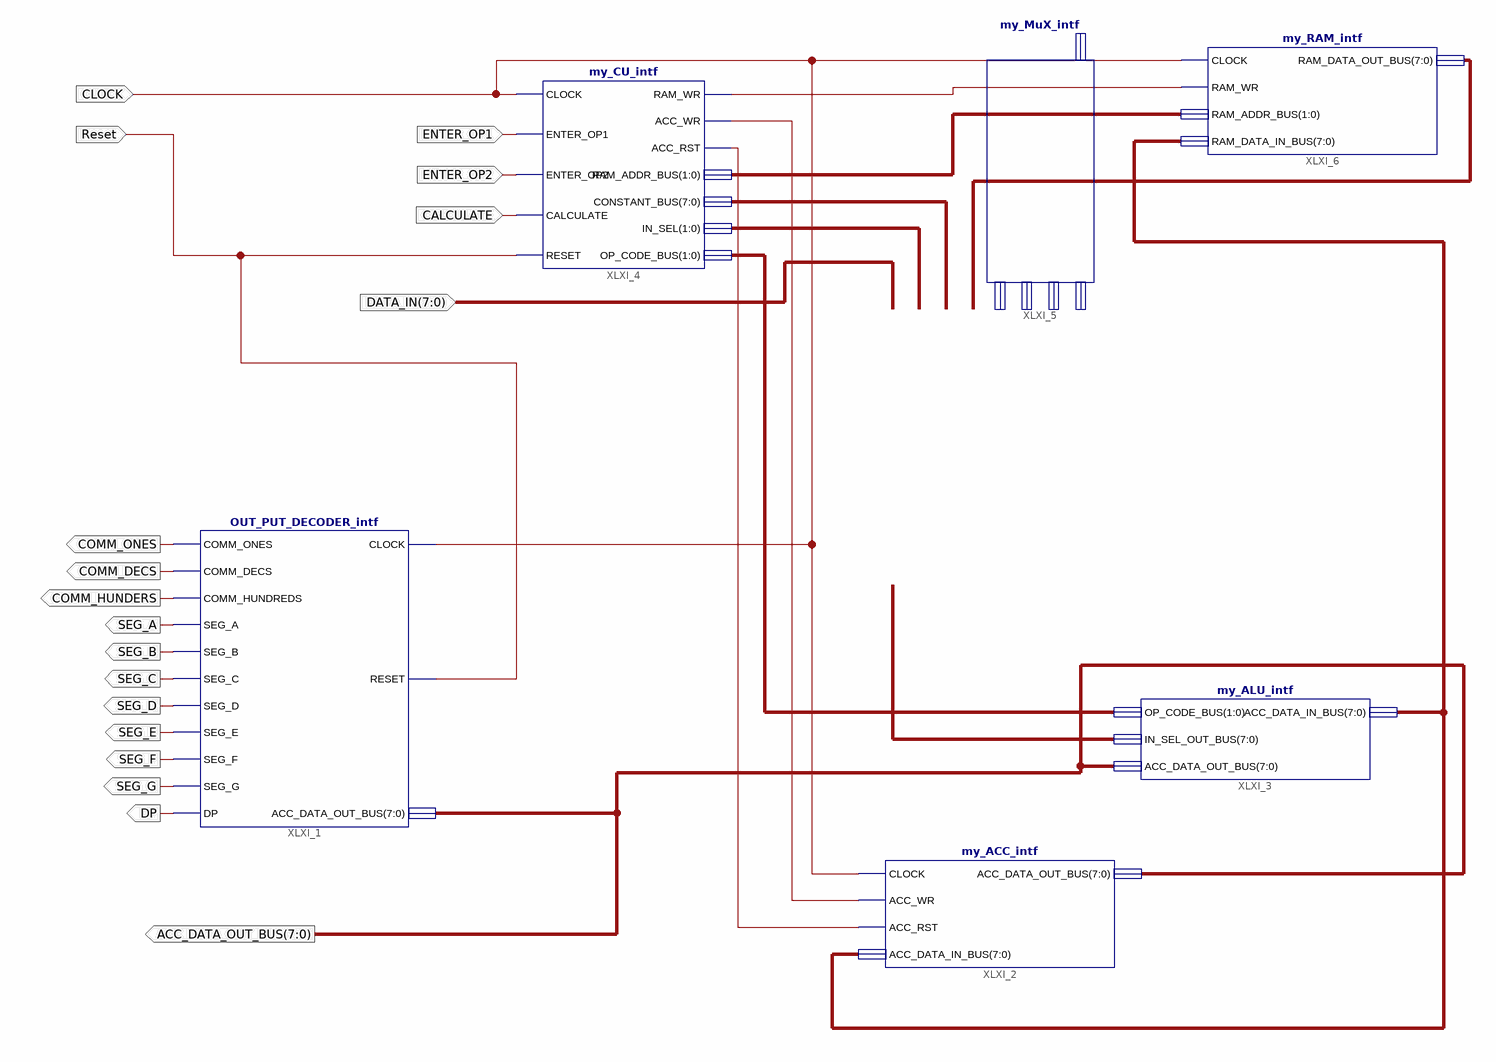
[diagram p0: schematic sheet 1]
// Xilinx ISE schematic Top_level.sch (spartan3a) as structural Verilog: 6 symbols, 18 ports
module Top_level (
  input  Reset,
  input  CLOCK,
  input  ENTER_OP1,
  input  ENTER_OP2,
  input  CALCULATE,
  input  [7:0] DATA_IN,
  output COMM_ONES,
  output COMM_DECS,
  output COMM_HUNDERS,
  output SEG_A,
  output SEG_B,
  output SEG_C,
  output SEG_D,
  output SEG_E,
  output SEG_F,
  output SEG_G,
  output DP,
  output [7:0] ACC_DATA_OUT_BUS
);

  wire XLXN_11, XLXN_26, XLXN_27;
  wire [1:0] XLXN_15, XLXN_22, XLXN_28;
  wire [7:0] XLXN_12, XLXN_21, XLXN_29, XLXN_30;

  OUT_PUT_DECODER_intf XLXI_1 (
    .CLOCK(CLOCK), .RESET(Reset), .ACC_DATA_OUT_BUS(ACC_DATA_OUT_BUS), .COMM_ONES(COMM_ONES),
    .COMM_DECS(COMM_DECS), .COMM_HUNDREDS(COMM_HUNDERS), .SEG_A(SEG_A), .SEG_B(SEG_B), .SEG_C(SEG_C),
    .SEG_D(SEG_D), .SEG_E(SEG_E), .SEG_F(SEG_F), .SEG_G(SEG_G), .DP(DP));
  my_ACC_intf XLXI_2 (
    .CLOCK(CLOCK), .ACC_WR(XLXN_26), .ACC_RST(XLXN_27), .ACC_DATA_IN_BUS(XLXN_30),
    .ACC_DATA_OUT_BUS(ACC_DATA_OUT_BUS));
  my_ALU_intf XLXI_3 (
    .OP_CODE_BUS(XLXN_28), .IN_SEL_OUT_BUS(XLXN_29), .ACC_DATA_OUT_BUS(ACC_DATA_OUT_BUS),
    .ACC_DATA_IN_BUS(XLXN_30));
  my_CU_intf XLXI_4 (
    .CLOCK(CLOCK), .ENTER_OP1(ENTER_OP1), .ENTER_OP2(ENTER_OP2), .CALCULATE(CALCULATE), .RESET(Reset),
    .RAM_WR(XLXN_11), .ACC_WR(XLXN_26), .ACC_RST(XLXN_27), .RAM_ADDR_BUS(XLXN_15), .CONSTANT_BUS(XLXN_21),
    .IN_SEL(XLXN_22), .OP_CODE_BUS(XLXN_28));
  my_MuX_intf XLXI_5 (
    .DATA_IN(DATA_IN), .IN_SEL(XLXN_22), .CONSTANT_BUS(XLXN_21), .RAM_DATA_OUT_BUS(XLXN_12),
    .IN_SEL_OUT_BUS(XLXN_29));
  my_RAM_intf XLXI_6 (
    .CLOCK(CLOCK), .RAM_WR(XLXN_11), .RAM_ADDR_BUS(XLXN_15), .RAM_DATA_IN_BUS(XLXN_30),
    .RAM_DATA_OUT_BUS(XLXN_12));
endmodule
